# Altium schematic sheet Pg16_PSU.SchDoc: POWER SUPPLY
size A2; DrawnBy: RvS; DocumentNumber: 16; SheetNumber: 16; SheetTotal: 16; DocumentName: Power Supply; ProjectName: ARMflash Mini
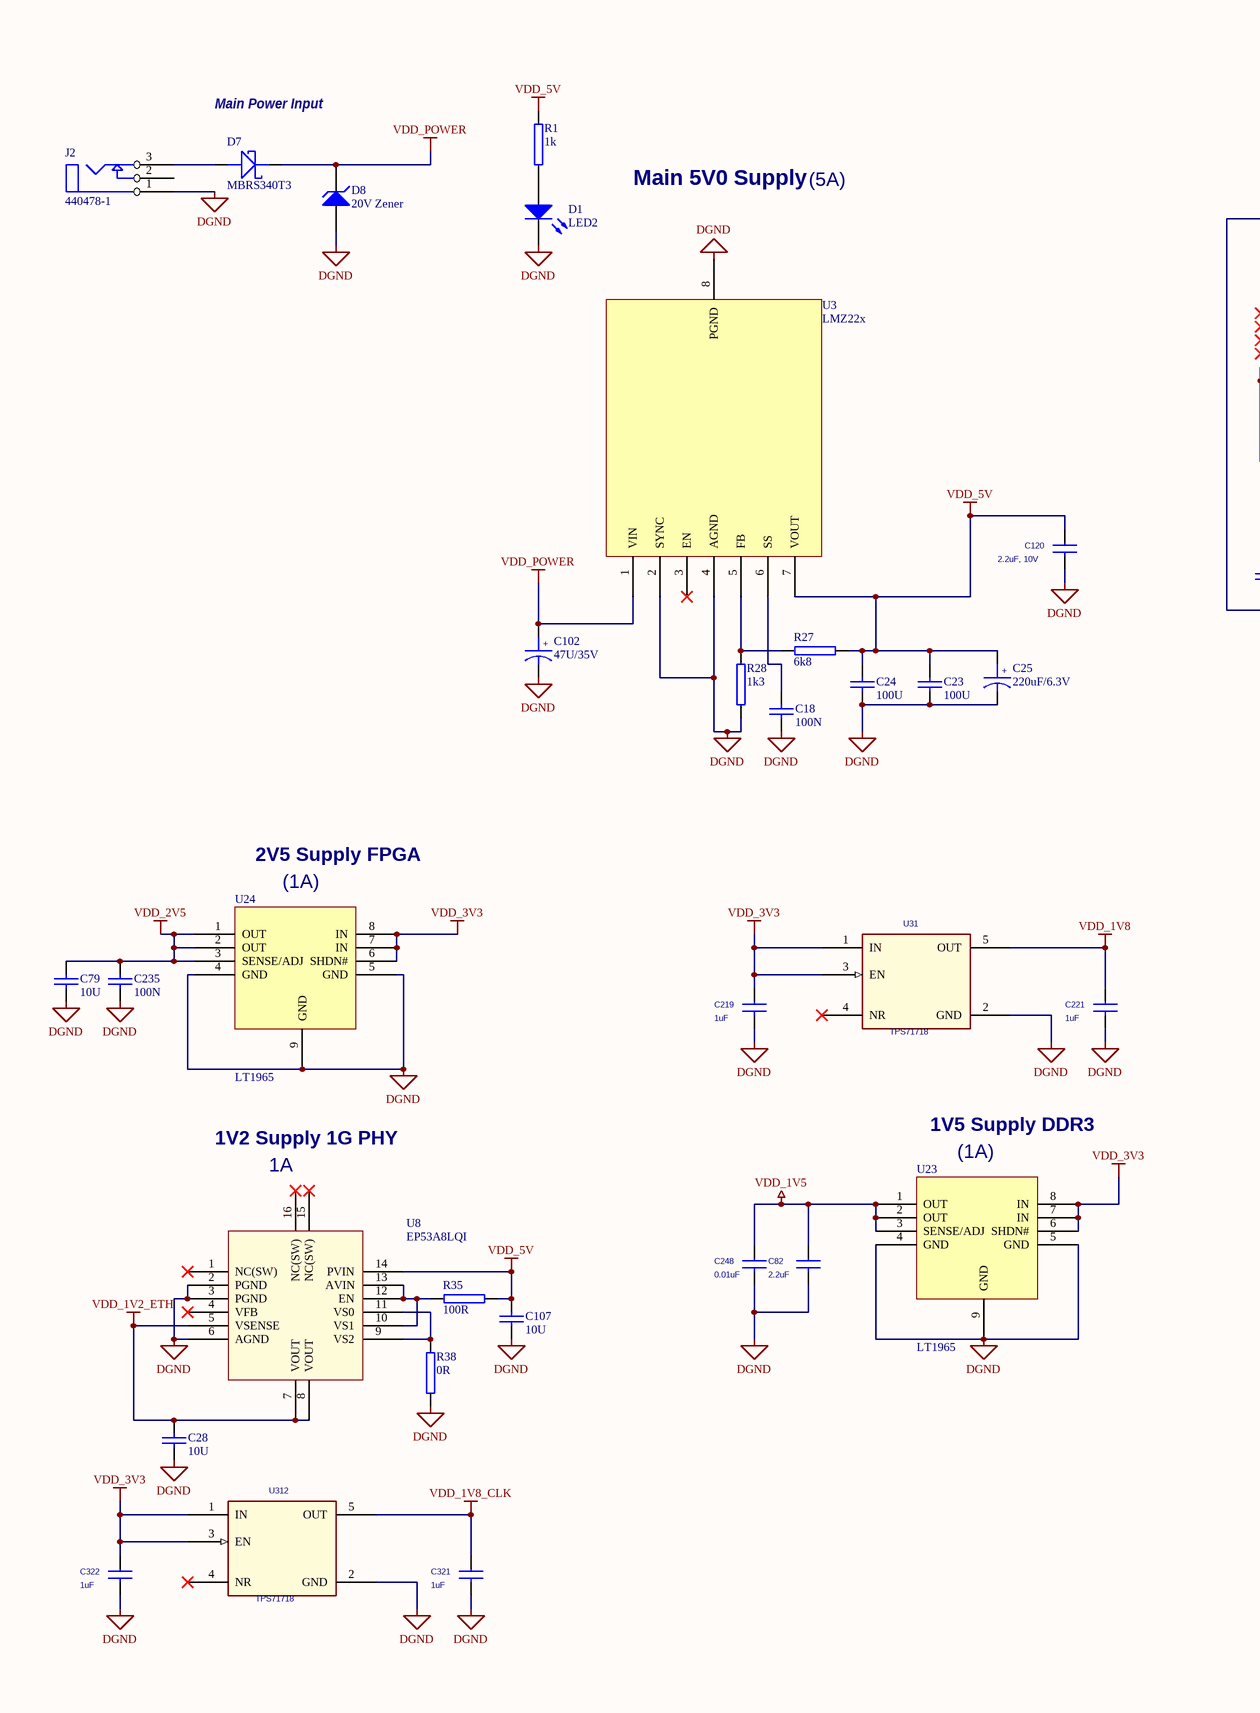
[diagram p0: Pg16_PSU.SchDoc, left]
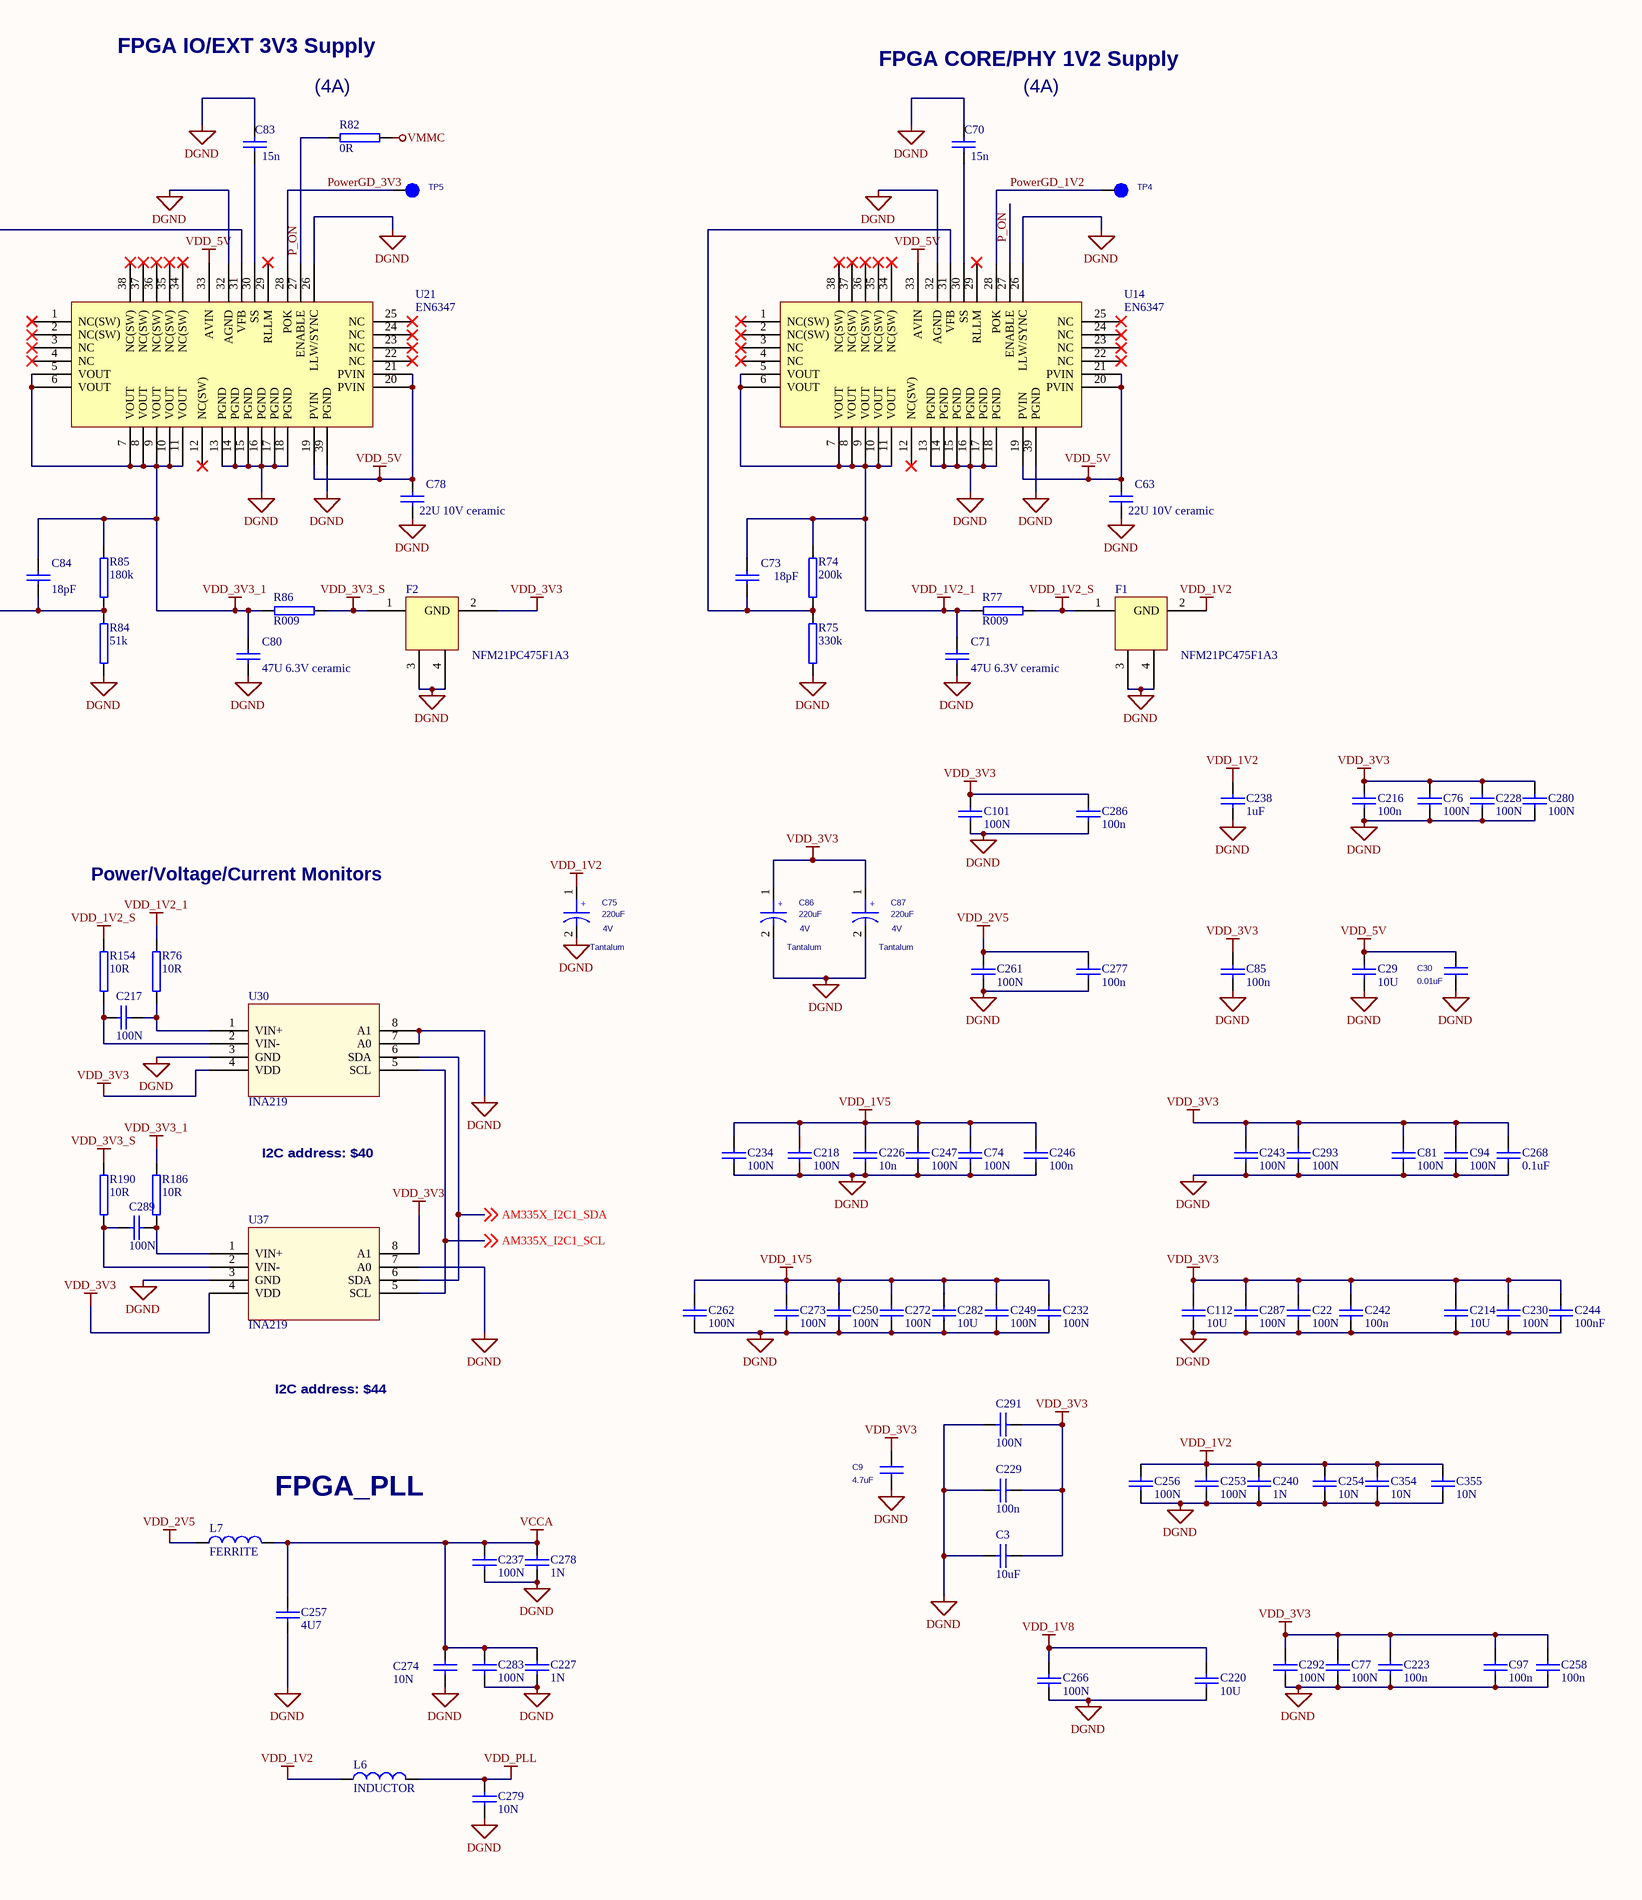
[diagram p1: Pg16_PSU.SchDoc, right]

## Parts
?  (no value)  (graphical)
C3  10uF  [SC0603]
C9  4.7uF  [SM-7351-CAP-0603]
C18  100N  [sc0402]
C22  100N  [0603]
C23  100U  [1206]
C24  100U  [1206]
C25  220uF/6.3V  [CASED]
C28  10U  [SC0603]
C29  10U  [0805]
C30  0.01uF  [SM-7351-CAP-0402]
C63  22U 10V ceramic  [1206]
C70  15n  [sc0402]
C71  47U 6.3V ceramic  [1206]
C73  18pF  [sc0402]
C74  100N  [0603]
C75  220uF  Working Voltage: 4V  Dielectric: Tantalum  [1210]
C76  100N  [sc0402]
C77  100N  [0603]
C78  22U 10V ceramic  [1206]
C79  10U  [sc0603]
C80  47U 6.3V ceramic  [1206]
C81  100N  [0603]
C82  2.2uF  [SM-7351-CAP-0805]
C83  15n  [sc0402]
C84  18pF  [sc0402]
C85  100n  [0603]
C86  220uF  Working Voltage: 4V  Dielectric: Tantalum  [1210]
C87  220uF  Working Voltage: 4V  Dielectric: Tantalum  [1210]
C94  100N  [0603]
C97  100n  [0603]
C101  100N  [0603]
C102  47U/35V  [CASED]
C107  10U  [SC0603]
C112  10U  [SC0603]
C120  2.2uF, 10V  [SM-7351-CAP-0402]
C214  10U  [0603]
C216  100n  [0603]
C217  100N  [sc0402]
C218  100N  [0603]
C219  1uF  [SM-7351-CAP-0402]
C220  10U  [sc0603]
C221  1uF  [SM-7351-CAP-0402]
C223  100n  [0603]
C226  10n  [0603]
C227  1N  [sc0402]
C228  100N  [0603]
C229  100n  [0603]
C230  100N  [0603]
C232  100N  [0603]
C234  100N  [SM-7351-CAP-0402]
C235  100N  [sc0402]
C237  100N  [sc0402]
C238  1uF  [sc0402]
C240  1N  [SM-7351-CAP-0402]
C242  100n  [0603]
C243  100N  [0603]
C244  100nF  [0603]
C246  100n  [SM-7351-CAP-0402]
C247  100N  [SM-7351-CAP-0402]
C248  0.01uF  [SM-7351-CAP-0402]
C249  100N  [0603]
C250  100N  [0603]
C253  100N  [SM-7351-CAP-0402]
C254  10N  [SM-7351-CAP-0402]
C256  100N  [SM-7351-CAP-0402]
C257  4U7  [0603]
C258  100n  [0603]
C261  100N  [sc0402]
C262  100N  [sc0402]
C266  100N  [sc0402]
C268  0.1uF  [sc0402]
C272  100N  [0603]
C273  100N  [sc0402]
C274  10N  [SC0603]
C277  100n  [0603]
C278  1N  [sc0402]
C279  10N  [SM-7351-CAP-0402]
C280  100N  [0603]
C282  10U  [sc0603]
C283  100N  [sc0402]
C286  100n  [0603]
C287  100N  [0603]
C289  100N  [sc0402]
C291  100N  [sc0402]
C292  100N  [0603]
C293  100N  [0603]
C321  1uF  [SM-7351-CAP-0402]
C322  1uF  [SM-7351-CAP-0402]
C354  10N  [SM-7351-CAP-0402]
C355  10N  [SM-7351-CAP-0402]
D1  LED2  [0603]
D7  MBRS340T3  [SMC]
D8  20V Zener  [SMB]
F1  NFM21PC475F1A3  [EM chip filter 0805]
F2  NFM21PC475F1A3  [EM chip filter 0805]
J2  440478-1  [CON_POWER]
L6  INDUCTOR  [sc0603]
L7  FERRITE  [SC0603]
R1  1k  [0603]
R27  6k8  [sc0402]
R28  1k3  [sc0402]
R35  100R  [sc0402]
R38  0R  [sc0402]
R74  200k  [sc0402]
R75  330k  [sc0402]
R76  10R  [sc0402]
R77  R009  [1206]
R82  0R  [sc0402]
R84  51k  [sc0402]
R85  180k  [sc0402]
R86  R009  [1206]
R154  10R  [sc0402]
R186  10R  [sc0402]
R190  10R  [sc0402]
TP4  TP1mm  [tp_smd1mmcircle]  (value not drawn)
TP5  TP1mm  [tp_smd1mmcircle]  (value not drawn)
U3  LMZ22x  [TZA07A]
U8  EP53A8LQI  [LCC 16pin 3x3 mm]
U14  EN6347  [EN6347QI - DFN]
U21  EN6347  [EN6347QI - DFN]
U23  LT1965  [DD package]
U24  LT1965  [DD package]
U30  INA219  [SOT23-8]
U31  TPS71718  [smdsc70-5]
U37  INA219  [SOT23-8]
U312  TPS71718  [smdsc70-5]

## Nets
DGND: C3.1 C9.2 C18.2 C22.2 C23.2 C24.2 C25.2 C28.2 C29.2 C30.2 C63.1 C70.1 C71.1 C74.2 C75.2 C76.2 C77.2 C78.1 C79.2 C80.1 C81.2 C82.2 C83.1 C85.2 C86.2 C87.2 C94.2 C97.2 C101.2 C102.2 C107.2 C112.2 C120.2 C214.2 C216.2 C218.2 C219.2 C220.2 C221.2 C223.2 C226.2 C227.2 C228.2 C229.1 C230.2 C232.2 C234.2 C235.2 C237.2 C238.2 C240.2 C242.2 C243.2 C244.2 C246.2 C247.2 C248.2 C249.2 C250.2 C253.2 C254.2 C256.2 C257.2 C258.2 C261.2 C262.2 C266.2 C268.2 C272.2 C273.2 C274.1 C277.2 C278.2 C279.1 C280.2 C282.2 C283.2 C286.2 C287.2 C291.1 C292.2 C293.2 C321.2 C322.2 C354.2 C355.2 D1.2(K) D8.1(A) F1.3 F1.4 F2.3 F2.4 J2.1 R28.2 R38.2 R75.1 R84.1 U3.2(SYNC) U3.4(AGND) U3.8(PGND) U8.2(PGND) U8.3(PGND) U8.6(AGND) U14.13(PGND) U14.14(PGND) U14.15(PGND) U14.16(PGND) U14.17(PGND) U14.18(PGND) U14.26(LLW/SYNC) U14.32(AGND) U14.39(PGND) U21.13(PGND) U21.14(PGND) U21.15(PGND) U21.16(PGND) U21.17(PGND) U21.18(PGND) U21.26(LLW/SYNC) U21.32(AGND) U21.39(PGND) U23.4(GND) U23.5(GND) U23.9(GND) U24.4(GND) U24.5(GND) U24.9(GND) U30.3(GND) U30.7(A0) U30.8(A1) U31.2(GND) U37.3(GND) U37.7(A0) U312.2(GND)
VCCA: C227.1 C237.1 C257.1 C274.2 C278.1 C283.1 L7.1
VDD_1V2: C75.1 C238.1 C240.1 C253.1 C254.1 C256.1 C354.1 C355.1 F1.2(GND) L6.2
VDD_1V2_1: C71.2 C73.1 R74.2 R76.1 R77.1 U14.5(VOUT) U14.6(VOUT) U14.7(VOUT) U14.8(VOUT) U14.9(VOUT) U14.10(VOUT) U14.11(VOUT)
VDD_1V2_ETH: C28.1 U8.5(VSENSE) U8.7(VOUT) U8.8(VOUT)
VDD_1V2_S: F1.1 R77.2 R154.1
VDD_1V5: C74.1 C82.1 C218.1 C226.1 C232.1 C234.1 C246.1 C247.1 C248.1 C249.1 C250.1 C262.1 C272.1 C273.1 C282.1 U23.1(OUT) U23.2(OUT) U23.3(SENSE/ADJ)
VDD_1V8: C220.1 C221.1 C266.1 U31.5(OUT)
VDD_1V8_CLK: C321.1 U312.5(OUT)
VDD_2V5: C79.1 C235.1 C261.1 C277.1 L7.2 U24.1(OUT) U24.2(OUT) U24.3(SENSE/ADJ)
VDD_3V3: C3.2 C9.1 C22.1 C76.1 C77.1 C81.1 C85.1 C86.1 C87.1 C94.1 C97.1 C101.1 C112.1 C214.1 C216.1 C219.1 C223.1 C228.1 C229.2 C230.1 C242.1 C243.1 C244.1 C258.1 C268.1 C280.1 C286.1 C287.1 C291.2 C292.1 C293.1 C322.1 F2.2(GND) U23.6(SHDN#) U23.7(IN) U23.8(IN) U24.6(SHDN#) U24.7(IN) U24.8(IN) U30.4(VDD) U31.1(IN) U31.3(EN) U37.4(VDD) U37.8(A1) U312.1(IN) U312.3(EN)
VDD_3V3_1: C80.2 C84.1 R85.2 R86.1 R186.1 U21.5(VOUT) U21.6(VOUT) U21.7(VOUT) U21.8(VOUT) U21.9(VOUT) U21.10(VOUT) U21.11(VOUT)
VDD_3V3_S: F2.1 R86.2 R190.1
VDD_5V: C23.1 C24.1 C25.1 C29.1 C30.1 C63.2 C78.2 C107.1 C120.1 R1.2 R27.1 R35.1 U3.7(VOUT) U8.14(PVIN) U14.19(PVIN) U14.20(PVIN) U14.21(PVIN) U14.33(AVIN) U21.19(PVIN) U21.20(PVIN) U21.21(PVIN) U21.33(AVIN)
VDD_PLL: C279.2 L6.1
VDD_POWER: C102.1 D7.2(CATHODE) D8.2(K) U3.1(VIN)
VMMC: R82.1
AM335X_I2C1_SCL: U30.5(SCL) U37.5(SCL) ; off-sheet AM335X_I2C1_SCL
AM335X_I2C1_SDA: U30.6(SDA) U37.6(SDA) ; off-sheet AM335X_I2C1_SDA
P_ON: R82.2 U14.27(ENABLE) U21.27(ENABLE)
PowerGD_1V2: TP4.1 U14.28(POK)
PowerGD_3V3: TP5.1 U21.28(POK)
NetC18_1: C18.1 U3.6(SS)
NetC70_2: C70.2 U14.30(SS)
NetC73_2: C73.2 R74.1 R75.2 U14.31(VFB)
NetC83_2: C83.2 U21.30(SS)
NetC84_2: C84.2 R84.2 R85.1 U21.31(VFB)
NetC217_1: C217.1 R154.2 U30.2(VIN-)
NetC217_2: C217.2 R76.2 U30.1(VIN+)
NetC289_1: C289.1 R190.2 U37.2(VIN-)
NetC289_2: C289.2 R186.2 U37.1(VIN+)
NetD1_1: D1.1(A) R1.1
NetD7_1: D7.1(ANODE) J2.3
NetR27_2: R27.2 R28.1 U3.5(FB)
NetR35_2: R35.2 U8.10(VS1) U8.12(EN) U8.13(AVIN)
NetR38_1: R38.1 U8.9(VS2) U8.11(VS0)

Not connected (* = marked no-connect by the designer): J2 2; U3 3(EN)*; U8 1(NC(SW))* 4(VFB)* 15(NC(SW))* 16(NC(SW))*; U14 1(NC(SW))* 2(NC(SW))* 3(NC)* 4(NC)* 12(NC(SW))* 22(NC)* 23(NC)* 24(NC)* 25(NC)* 29(RLLM)* 34(NC(SW))* 35(NC(SW))* 36(NC(SW))* 37(NC(SW))* 38(NC(SW))*; U21 1(NC(SW))* 2(NC(SW))* 3(NC)* 4(NC)* 12(NC(SW))* 22(NC)* 23(NC)* 24(NC)* 25(NC)* 29(RLLM)* 34(NC(SW))* 35(NC(SW))* 36(NC(SW))* 37(NC(SW))* 38(NC(SW))*; U31 4(NR)*; U312 4(NR)*

## Notes on the sheet
- FPGA IO/EXT 3V3 Supply
- FPGA CORE/PHY 1V2 Supply
- Main Power Input
- (near R82) (4A)
- (4A)
- Main 5V0 Supply
- (5A)
- 2V5 Supply FPGA
- (near U24) (1A)
- Power/Voltage/Current Monitors
- 1V5 Supply DDR3
- 1V2 Supply 1G PHY
- 1A
- (near U23) (1A)
- I2C address: $40
- I2C address: $44
- (near L7) FPGA_PLL
- Embedded Vision Systems Group
- Title
- School of Electrical and Electronic Engineering
- Date:
- Size
- Document Number
- Sheet
- of
- Rev
- (in symbol CAP POL) +
- (in symbol CAP_SMD_POL) +

## Library data of the parts
? = Title Block Address(1): UoM title block
C3 C18 C22-C24 C28 C29 C74 C76 C77 C79 C81 C85 C94 C97 C101 C107 C112 C214 C216-C218 C220 C223 C226-C230 C232 C234 C235 C237 C238 C240 C242-C244 C246 C247 C249 C250 C253 C254 C256-C258 C261 C262 C266 C268 C272-C274 C277-C280 C282 C283 C286 C287 C289 C291-C293 C354 C355 = CAP: NON-POLARISED CAP
C9 = 4.7uFCapacitor16V10%0603: TIIntPartnumber: 1C0103; MfrNum: EMK107ABJ475KA-T; Mfr: Taiyo Yuden; PartName: 4.7uF16V10%SMD0603; Cost10K: 0.00590; Cost100: 0.0198; Vendor: Digikey; DescriptiveText: Capacitor Ceramic 4.7uF 16V 10% 0603
C25 C102 = CAP POL: POLARISED CAPACITOR
C30 C248 = 0.01uFCapacitor16V10%0402_Dup1: Mfr: Panasonic; PartName: 0.01uF16V10%SMD0402; MfrNum: ECJ-0YB1C103K; TIIntPartnumber: 1C0012; PN: 0402YC103KAT2A; TN: 207-0054-000; Vendor: Digikey; Cost100: 0.00; Cost10K: 0.015; DescriptiveText: Capacitor 0.01uF 16V 10% 0402
C63 C70 C71 C73 C78 C80 C83 C84 = CAP: NON-POLARISED CAP; Part Field 1: 1; Part Field 10: 1000u; Part Field 2: 0; Part Field 3: 0; Part Field 4: 0; Part Field 5: 1; Part Field 6: 1000K; Part Field 7: 1u; Part Field 8: 1u; Part Field 9: 500u
C75 C86 C87 = CAP_SMD_POL: CAP - TANTALUM, 330UF, 10%, 4V, 700MOHM ESR, 6032-28; MFR_LIFECYCLE: Active; Manufacturer: Kemet Corporation; Manufacturer Part Num: T495C337K004ATE700; PART_SUBCLASS: CAPACITORS; Tolerance: +/-10%; Num Pins: 2; Item Num: P03-16152R; RoHS Compliant: RoHS Compliant; Lead Free Status: Lead Free; RATED_VOLTAGE: 4V; CAPACITANCE: 330uF; AGILE_LINK: http://sj-agile9app/Agile/PLMServlet?action=OpenEmailObject&classid=10000&objid=259660590; LIFECYCLE_PHASE: Preliminary
C82 = 2.2uF16V10%SMD0805: Capacitor 2.2uF 16V 10% 0805; TIIntPartnumber: 1C0097; MfrNum: C0805C225K4RACTU; Mfr: Kemet; Cost10K: 0.3592; Cost100: 0.5895; Vendor: Digikey; DescriptiveText: Capacitor 2.2uF 16V 10% 0805; PartName: 2.2uF16V10%SMD0805; Descriptive_Text: Capacitor 2.2uF 16V 10% 0805
C120 = 2.2uFCapacitor10V20%smd0402: TIIntPartnumber: 1C0123; MfrNum: LMK105BJ225MV-F; Mfr: Taiyo Yuden; PartName: 2.2uF10V20%SMD0402; DescriptiveText: Capacitor 2.2uF 10V 20% Ceramic 0402; Cost10K: 0.xx; Vendor: Digikey; TN: 207-0054-000; Cost100: 0.xx; PN: -
C219 C221 C321 C322 = 1uFCapacitor10V10%0402: TIIntPartnumber: 1C0084; MfrNum: 0402ZD105KAT2A; Mfr: AVX; PartName: 1uF10V10%0402; DescriptiveText: Capacitor 1uF 10V Ceramic 10% 0402; Cost10K: 0.201; Cost100: 0.336; Vendor: Digikey
D1 = LED2: Typical RED, GREEN, YELLOW, AMBER GaAs LED; Published: 8-Jun-2000; LatestRevisionDate: 17-Jul-2002; LatestRevisionNote: Re-released for DXP Platform.; PackageReference: 3.2X1.6X1.1; Publisher: Altium Limited; PackageVersion: Feb-2002
D7 = MBRS340T3: SCHOTTKY DIODE
D8 = D Zener: Zener Diode; Published: 8-Jun-2000; LatestRevisionDate: 17-Jul-2002; LatestRevisionNote: Re-released for DXP Platform.; PackageReference: DIODE-0.7; Publisher: Altium Limited
F1 F2 = NFM41PC204F1H3: 3 terminal feedthough filter capacitor; Farnell Order Code: 1686512
J2 = CON_POWER: 2.1mm power connector
L7 = INDUCTOR
R1 R27 R28 R76 R154 R186 R190 = RES: RESISTOR
R35 R38 R74 R75 R82 R84 R85 = RES: RESISTOR; Part Field 1: 1; Part Field 10: 1000u; Part Field 2: 0; Part Field 3: 0; Part Field 4: 0; Part Field 5: 1; Part Field 6: 1000K; Part Field 7: 1u; Part Field 8: 1u; Part Field 9: 500u
R77 R86 = RES: Resistor
TP4 TP5 = Testpoint_SMD1mmCircle: Testpoint SMD 1mm circle pad; TIIntPartnumber: 2H0046; Cost10K: 0.00; Cost100: 0; Descriptive_Text: Testpoint SMD 1mm circle pad; Vendor: N/A; MfrNum: N/A; Mfr: N/A; PartName: TestpointSMD1mmCircle; DescriptiveText: Testpoint SMD 1mm circle pad
U3 = LMZ22x: Power Module
U8 = EP53A8xQI
U14 U21 = EN6347QI: 4A PSU power module
U23 U24 = LT1965: LDO regulator adjustable
U30 U37 = INA219: Current/Power Monitor I2C
U31 U312 = TPS71718: Low Dropout 1.8V 150mA Linear Regulator; Mfr: TI; MfrNum: TPS71718DCK; TIIntPartnumber: 1A0262; Vendor: Digikey; Cost100: 1.21; Cost10K: 0.7560; DescriptiveText: Low Dropout 1.8V 150mA Linear Regulator; PartName: TPS71718; Descriptive_Text: Low Dropout 1.8V 150mA Linear Regulator